# EAGLE design rs485_ISO_IO (EAGLE 8.5.2)
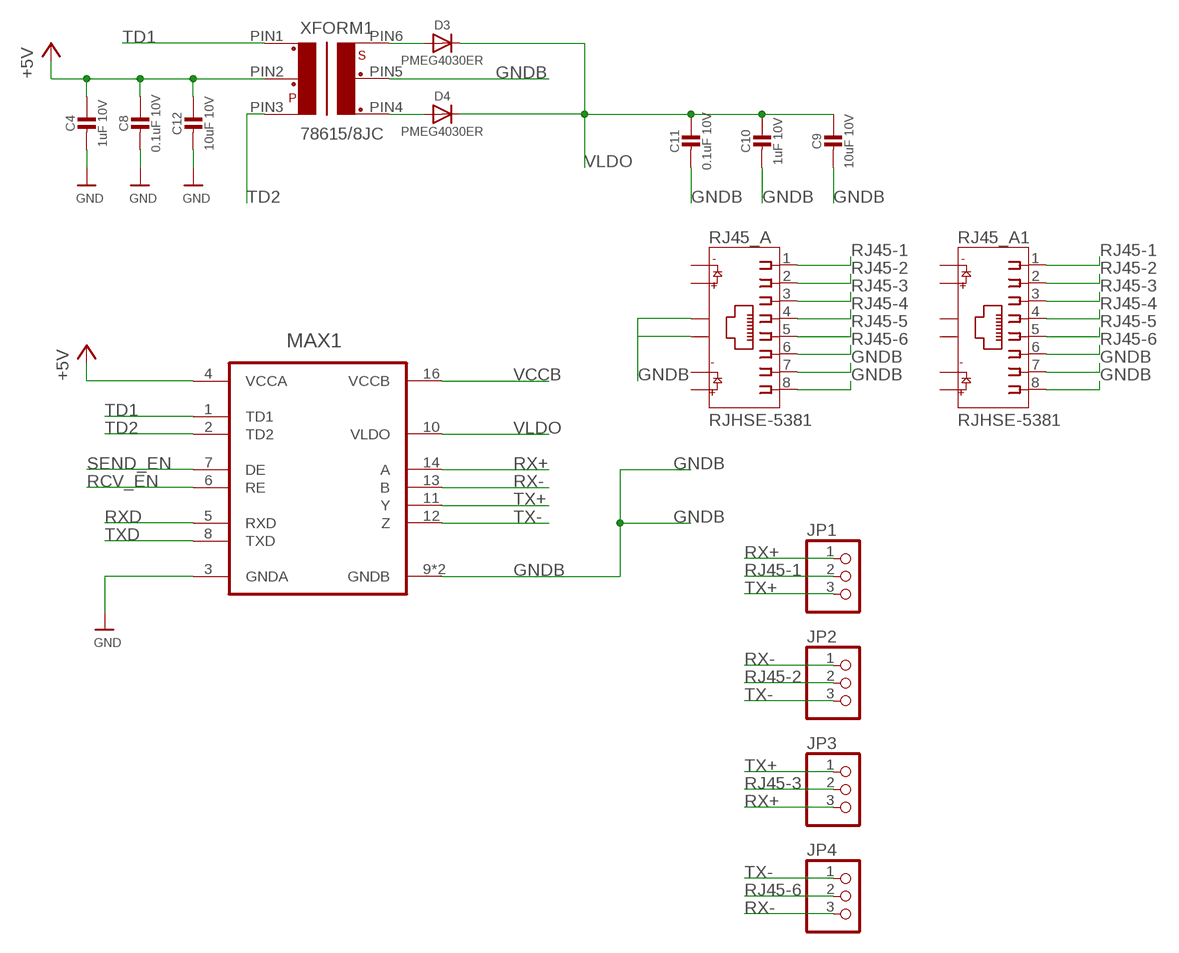
[diagram p0: schematic, sheet 1]

## Parts
C4  1uF 10V  CAP_CERAMIC0603MINI  [0603-MINI]
C8  0.1uF 10V  CAP_CERAMIC0603MINI  [0603-MINI]
C9  10uF 10V  CAP_CERAMIC0603MINI  [0603-MINI]
C10  1uF 10V  CAP_CERAMIC0603MINI  [0603-MINI]
C11  0.1uF 10V  CAP_CERAMIC0603MINI  [0603-MINI]
C12  10uF 10V  CAP_CERAMIC0603MINI  [0603-MINI]
D3  PMEG4030ER  DIODESOD-123  [SOD-123]
D4  PMEG4030ER  DIODESOD-123  [SOD-123]
JP1  PINHD-1X3  [1X03]
JP2  PINHD-1X3  [1X03]
JP3  PINHD-1X3  [1X03]
JP4  PINHD-1X3  [1X03]
MAX1  MAX14853GWE+  [SOIC127P1034X267-16N]
RJ45_A  RJHSE-5381  [AMPHENOL_RJHSE-5381]
RJ45_A1  RJHSE-5381  [AMPHENOL_RJHSE-5381]
XFORM1  78615/8JC  [0.1_SMD]

## Nets
+5V: C4.1 C8.1 C12.1 MAX1.4(VCCA) XFORM1.PIN2
GND: C4.2 C8.2 C12.2 MAX1.3(GNDA)
GNDB: C9.2 C10.2 C11.2 MAX1.9(GNDB) MAX1.15(GNDB) RJ45_A1.7 RJ45_A1.8 RJ45_A.7 RJ45_A.8 RJ45_A.S1 RJ45_A.S2 XFORM1.PIN5
N$3: D3.A XFORM1.PIN6
N$4: D4.A XFORM1.PIN4
RCV_EN: MAX1.6(RE)
RJ45-1: JP1.2 RJ45_A1.1 RJ45_A.1
RJ45-2: JP2.2 RJ45_A1.2 RJ45_A.2
RJ45-3: JP3.2 RJ45_A1.3 RJ45_A.3
RJ45-4: RJ45_A1.4 RJ45_A.4
RJ45-5: RJ45_A1.5 RJ45_A.5
RJ45-6: JP4.2 RJ45_A1.6 RJ45_A.6
RX+: JP1.1 JP3.3 MAX1.14(A)
RX-: JP2.1 JP4.3 MAX1.13(B)
RXD: MAX1.5(RXD)
SEND_EN: MAX1.7(DE)
TD1: MAX1.1(TD1) XFORM1.PIN1
TD2: MAX1.2(TD2) XFORM1.PIN3
TX+: JP1.3 JP3.1 MAX1.11(Y)
TX-: JP2.3 JP4.1 MAX1.12(Z)
TXD: MAX1.8(TXD)
VCCB: MAX1.16(VCCB)
VLDO: C9.1 C10.1 C11.1 D3.C D4.C MAX1.10(VLDO)
Unconnected: RJ45_A1.9 RJ45_A1.10 RJ45_A1.11 RJ45_A1.12 RJ45_A1.S1 RJ45_A1.S2 RJ45_A.9 RJ45_A.10 RJ45_A.11 RJ45_A.12

## Library data of the parts
C4 C8-C12 = microbuilder:CAP_CERAMIC: Ceramic Capacitors For new designs, use the packages preceded by an '_' character since they are more reliable: The following footprints should be used on most boards: _0402 - Standard footprint for regular board layouts _0603 - Standard footprint for regular board layouts _0805 - Standard footprint for regular board layouts _1206 - Standard footprint for regular board layouts For extremely tight-pitch boards where space is at a premium, the following 'micro-pitch' footprints can be used (smaller pads, no silkscreen outline, etc.): _0402MP - Micro-pitch footprint for very dense/compact boards _0603MP - Micro-pitch footprint for very dense/compact boards _0805MP - Micro-pitch footprint for very dense/compact boards _1206MP - Micro-pitch footprint for very dense/compact boards
D3 D4 = microbuilder:DIODE: Diode SMA Model Volts Amps Type Vf Ir Digikey # Notes SSA34-E3 40V 3A Schottky 480mV @ 3A 200uA @ 40V SSA34-E3/61TGITR-ND CDBA120-G 20V 1A Schottky 500mV @ 1A 500uA @ 20V 641-1014-6-ND REEL MBRA210 10V 2A Schottky 350mV @ 2A 700uA @ 10V MBRA210LT3 SOD-123 Model Volts Amps Type Vf Ir Order # Notes BAT54T1G 30V 200mA Schottky 800mV @ 200mA 2uA @ 25V BAT54T1GOSTR-ND B0530W 30V 500mA Schottky 430mV @ 500mA 130uA @ 30V B0530W-FDICT-ND REEL MBR120 20V 1A Schottky 340mV @ 1A MBR120VLSFT1GOSCT-ND SOD-323 Model Volts Amps Type Vf Ir Order # Notes PMEG2005EJ 20V 500mA Schottky 355mV @ 500mA 568-4110-1-ND ZLLS410 10V 570mA Schottky 380mV @ 570mA ZLLS410CT-ND 1N4148WS 75V 150mA Silicon/Simple 1V 1N4148WSFSCT-ND REEL SOD-523 Model Volts Amps Type Vf Ir Order # Notes BAT54XV2 30V 200mA Schottky 0.8V @ 100mA BAT54XV2CT-ND TB751S 30V 30mA Schottky RB751S-40TE61CT-ND SOT23-R/W (R = Solder Paste/Reflow Ovens, W = Hand-Soldering) Model Volts Amps Type Vf Ir Order # Notes BAT54FILM 40V 300mA Schottky 497-7162-1-ND POWERDI-5 Model Volts Amps Type Vf Ir Order # Notes PDS560 60V 5A Schottky 670mV @ 5A 150uA @ 60V PDS560DICT-ND
JP1-JP4 = adafruit:PINHD-1X3: PIN HEADER
MAX1 = Maxim_By_element14_Batch_1:MAX14853GWE+: Isolated RS-485 Tranceiver
RJ45_A RJ45_A1 = RJHSE-5381:RJHSE-5381: connector, mod jack, rt angle pcb, shielded, led1-g, led2-y, single port, rj-45 8 cont; AVAILABILITY: Good; DESCRIPTION: CONN MOD JACK 8P8C R/A SHIELDED; MF: Amphenol; MP: RJHSE-5381; PACKAGE: None; PRICE: 1.11 USD
XFORM1 = trafo-murata:78615/8JC

## Board
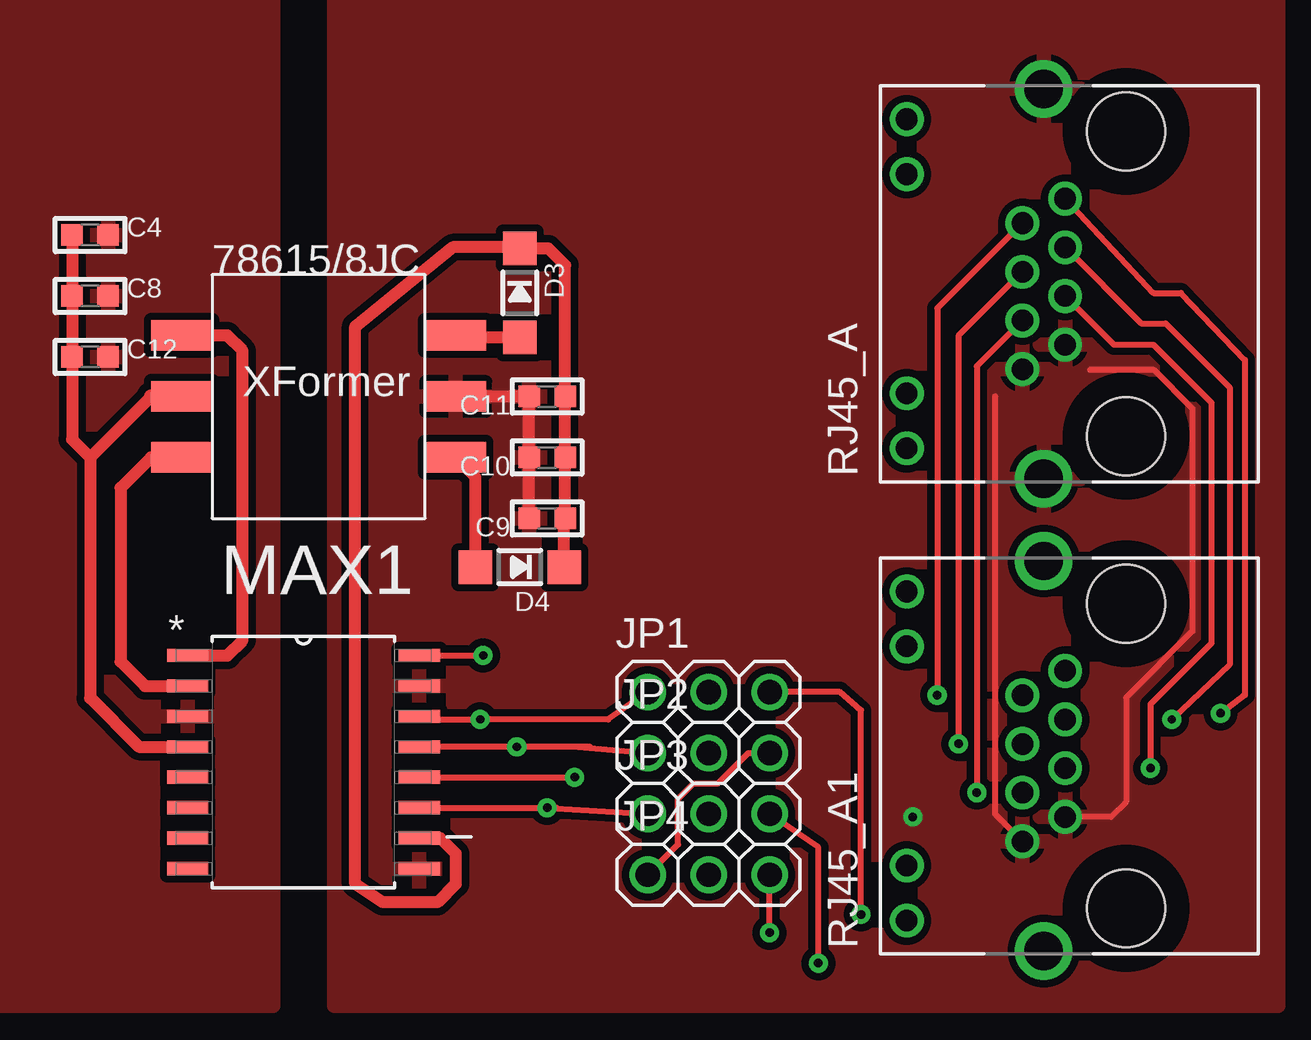
[diagram p1: board, top side]
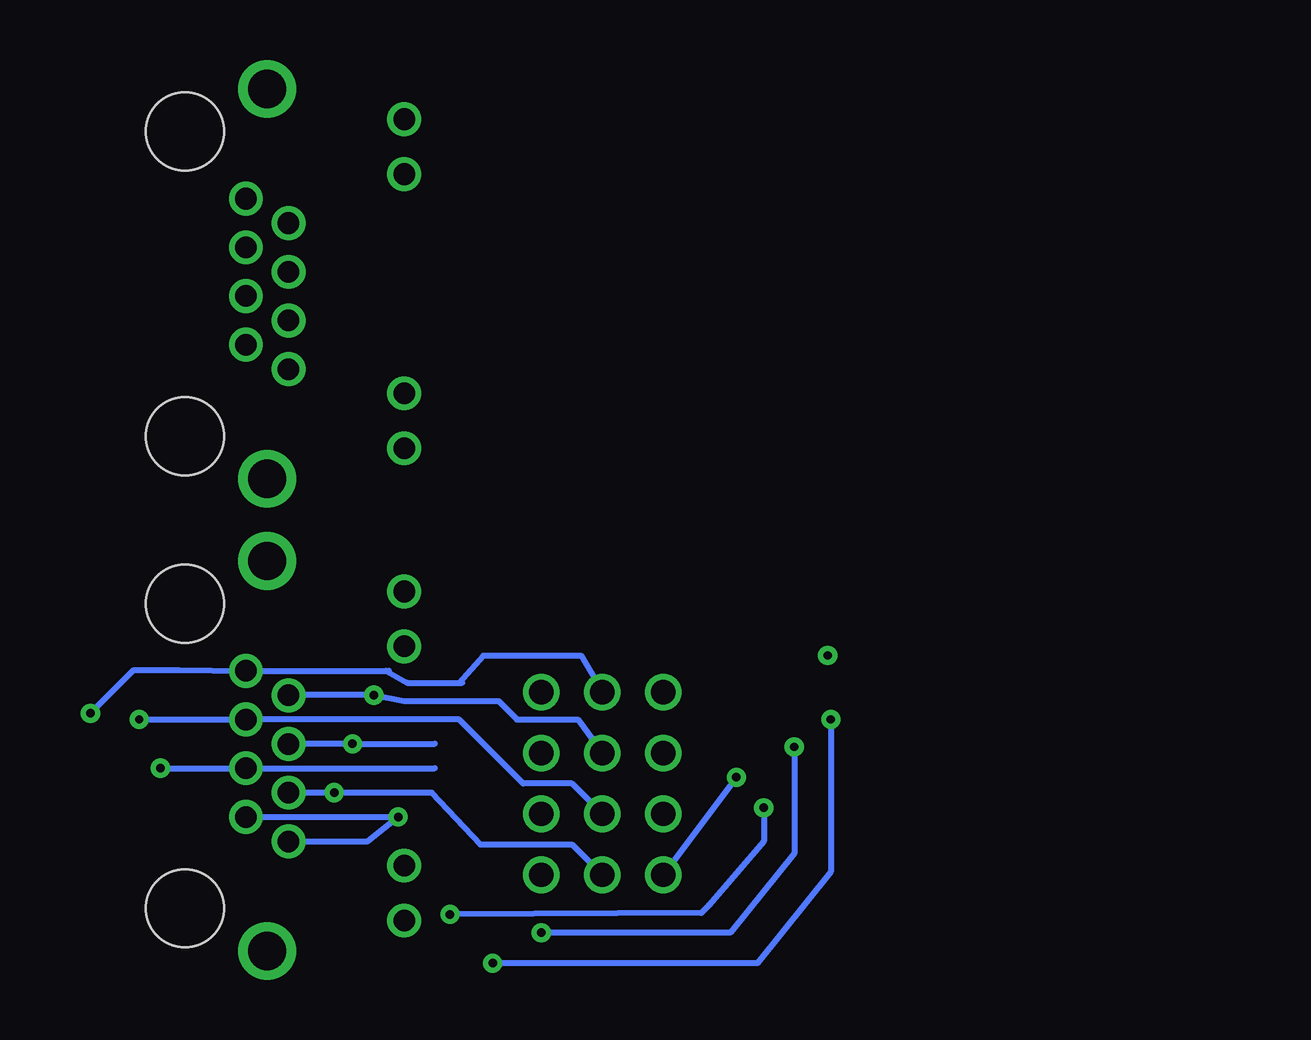
[diagram p2: board, bottom side, seen from below]

No outline drawn. Coordinates in mm, seen from the top.
Copper layers (1*16): Top 0.035mm / dielectric 1.5mm / Bottom 0.035mm
Design rules "default": minimum track width 6mil, minimum drill 0.35mm, track to track 6mil, track to pad 6mil, pad to pad 6mil, via to via 6mil, smd to smd 6mil, copper to edge 40mil, drill to drill 6mil, minimum pad ring 10mil, minimum via ring 8mil, stop-mask expansion 4mil, vias tented up to drill 0mil, thermal gap 10mil

### Footprints (pad centres in the part's own frame; a part is rotated, then mirrored left to right if it is on the bottom)
0603-MINI = smd 0.9 x 0.9: 1 -0.75,0; 2 0.75,0
SOD-123 = smd 1.4 x 1.4: A 1.85,0; C -1.85,0
1X03 = drill 1.016: 1 -2.54,0; 2 0,0; 3 2.54,0
SOIC127P1034X267-16N = smd 1.727 x 0.559: 1 -4.826,4.445; 2 -4.826,3.175; 3 -4.826,1.905; 4 -4.826,0.635; 5 -4.826,-0.635; 6 -4.826,-1.905; 7 -4.826,-3.175; 8 -4.826,-4.445; 9 4.826,-4.445; 10 4.826,-3.175; 11 4.826,-1.905; 12 4.826,-0.635; 13 4.826,0.635; 14 4.826,1.905; 15 4.826,3.175; 16 4.826,4.445
AMPHENOL_RJHSE-5381 = drill 0.9: 1 3.55,2.54; 2 2.53,4.32; 3 1.52,2.54; 4 0.5,4.32; 5 -0.51,2.54; 6 -1.53,4.32; 7 -2.54,2.54; 8 -3.56,4.32; 9 6.86,9.14; 10 4.57,9.14; 11 -4.57,9.14; 12 -6.86,9.14 | drill 1.6: S1 8.13,3.43; S2 -8.13,3.43 | hole 3.25: 6.35,0; -6.35,0
0.1_SMD = smd 2.54 x 1.27: PIN1 -11.43,1.27; PIN2 -11.43,-1.27; PIN3 -11.43,-3.81; PIN4 0,-3.81; PIN5 0,-1.27; PIN6 0,1.27

### Placement (x,y rotation side)
C4  22.86,63.88 0 top
C8  22.86,61.34 0 top
C9  41.91,52.07 180 top
C10  41.91,54.61 180 top
C11  41.91,57.15 180 top
C12  22.86,58.8 0 top
D3  40.77,61.47 270 top
D4  40.77,50.04 180 top
JP1  48.64,44.83 0 top
JP2  48.64,42.29 0 top
JP3  48.64,39.75 0 top
JP4  48.64,37.21 0 top
MAX1  31.75,41.91 0 top
RJ45_A  66.04,61.85 90 top
RJ45_A1  66.04,42.16 90 top
XFORM1  38.1,58.42 0 top

### Tracks (layer width: path | path; a pad name or v marks a point on that pad's centre or on a via)
+5V
  Top 0.508: 22.86,54.61 25.4,57.15 | 22.86,54.61 22.86,44.58 24.89,42.55 MAX1.4 | C4.1 C8.1 C12.1 22.11,55.36 22.86,54.61
  Top 0.61: 25.4,57.15 XFORM1.PIN2
GND
  pour Top (isolate 0.305): 30.48,74.93 30.48,31.75 8.89,31.75 8.89,74.93
GNDB  (via drill 0.35 pad 0.8)
  Top 0.254: 64.54,58.27 67.19,58.27 68.81,56.65 68.81,47.37 66.04,44.6 66.04,40.26 65.41,39.62 RJ45_A1.7 | RJ45_A1.8 60.58,39.74 60.58,57.15
  Top 0.508: C9.2 C11.2 XFORM1.PIN5
  Bottom 0.254: RJ45_A1.8 58.42,38.61 | 58.42,38.61 | 58.42,38.61 v57.15,39.62 RJ45_A1.7
  pour Top (isolate 0.305): 33.02,74.93 33.02,31.75 72.39,31.75 72.39,74.93
N$3
  Top 0.508: XFORM1.PIN6 38.17,59.62 D3.A
N$4
  Top 0.508: D4.A 38.92,53.79 XFORM1.PIN4
RJ45-1  (via drill 0.35 pad 0.8)
  Top 0.254: RJ45_A.1 67.18,61.47 68.33,61.47 70.99,58.67 70.99,44.7 v69.98,43.94
  Bottom 0.254: v69.98,43.94 68.17,45.75 66.29,45.75 RJ45_A1.1 57.66,45.72 | 57.66,45.72 57.53,45.72 | 57.66,45.72 56.77,45.21 54.61,45.21 | 54.61,45.21 54.48,45.21 | 54.61,45.21 53.59,46.35 49.53,46.35 JP1.2
RJ45-2  (via drill 0.35 pad 0.8)
  Top 0.254: RJ45_A.2 58.17,60.83 v58.17,44.7
  Bottom 0.254: RJ45_A1.2 61.71,44.7 v58.17,44.7 56.9,44.45 52.96,44.45 52.2,43.69 49.66,43.69 JP2.2
RJ45-3  (via drill 0.35 pad 0.8)
  Top 0.254: RJ45_A.3 66.67,60.2 67.69,60.2 70.36,57.53 70.36,45.97 v67.94,43.69
  Bottom 0.254: v67.94,43.69 RJ45_A1.3 54.61,43.69 51.94,41.02 49.91,41.02 JP3.2
RJ45-4  (via drill 0.35 pad 0.8)
  Top 0.254: RJ45_A.4 59.05,59.68 v59.05,42.67
  Bottom 0.254: RJ45_A1.4 59.06,42.66 v59.05,42.67 55.63,42.67
RJ45-5  (via drill 0.35 pad 0.8)
  Top 0.254: RJ45_A.5 65.53,59.31 67.18,59.31 69.6,56.9 69.6,46.86 67.06,44.32 v67.06,41.66
  Bottom 0.254: v67.06,41.66 v67.05,41.65 RJ45_A1.5 55.63,41.66
RJ45-6  (via drill 0.35 pad 0.8)
  Top 0.254: RJ45_A.6 59.82,58.42 v59.82,40.64
  Bottom 0.254: RJ45_A1.6 v59.82,40.63 v59.82,40.64 55.75,40.64 53.72,38.48 49.91,38.48 JP4.2
RX+  (via drill 0.35 pad 0.8)
  Top 0.254: MAX1.14 36.7,43.69 v39.12,43.69 44.45,43.69 JP1.1 | v53.21,33.53 53.21,38.35 JP3.3
  Bottom 0.254: v39.12,43.69 39.12,37.34 42.16,33.53 v53.21,33.53
RX-  (via drill 0.35 pad 0.8)
  Top 0.254: 43.69,42.55 43.18,42.55 | 43.18,42.55 v40.64,42.55 MAX1.13 | 43.18,42.55 JP2.1 | v51.18,34.8 JP4.3
  Bottom 0.254: v40.64,42.55 40.64,38.1 43.31,34.8 v51.18,34.8
TD1
  Top 0.508: MAX1.1 28.57,46.35 29.21,46.99 29.21,59.05 28.57,59.69 XFORM1.PIN1
TD2
  Top 0.508: XFORM1.PIN3 25.4,54.61 24.13,53.34 24.13,46.1 25.15,45.09 MAX1.2
TX+  (via drill 0.35 pad 0.8)
  Top 0.254: MAX1.11 v41.91,40.01 | v41.91,40.01 42.29,40.01 | v41.91,40.01 JP3.1 | v54.99,35.56 54.99,44.07 54.1,44.83 JP1.3
  Bottom 0.254: v41.91,40.01 41.91,38.61 44.2,35.94 44.51,35.62 v54.99,35.56
TX-  (via drill 0.35 pad 0.8)
  Top 0.254: MAX1.12 v43.05,41.27 | JP4.1 47.37,38.48 47.37,40.39 48.01,41.02 49.02,41.02 50.29,42.29 JP2.3
  Bottom 0.254: v43.05,41.27 JP4.1
VCCB  (via drill 0.35 pad 0.8)
  Top 0.254: MAX1.16 v39.24,46.35
VLDO
  Top 0.508: MAX1.10 37.47,38.73 38.1,38.1 38.1,36.83 37.34,36.07 35.05,36.07 33.91,36.83 33.91,60.07 37.97,63.37 40.71,63.37 D3.C 41.97,63.32 42.66,62.62 C11.1 C10.1 C9.1 42.67,52.06 42.62,52 D4.C